# Altium schematic sheet Tead_Aliens_64A_Display.SchDoc: Tead Aliens 64A Display
size A4; Date: 23/01/2021; CheckedBy: Nepermath; Author: Nepermath; DrawnBy: Nepermath; Engineer: Nepermath; DocumentNumber: Nepermath; Revision: 1; SheetNumber: 1; SheetTotal: 1; CurrentTime: 14:51; CurrentDate: 23/01/2021; Time: 23:01
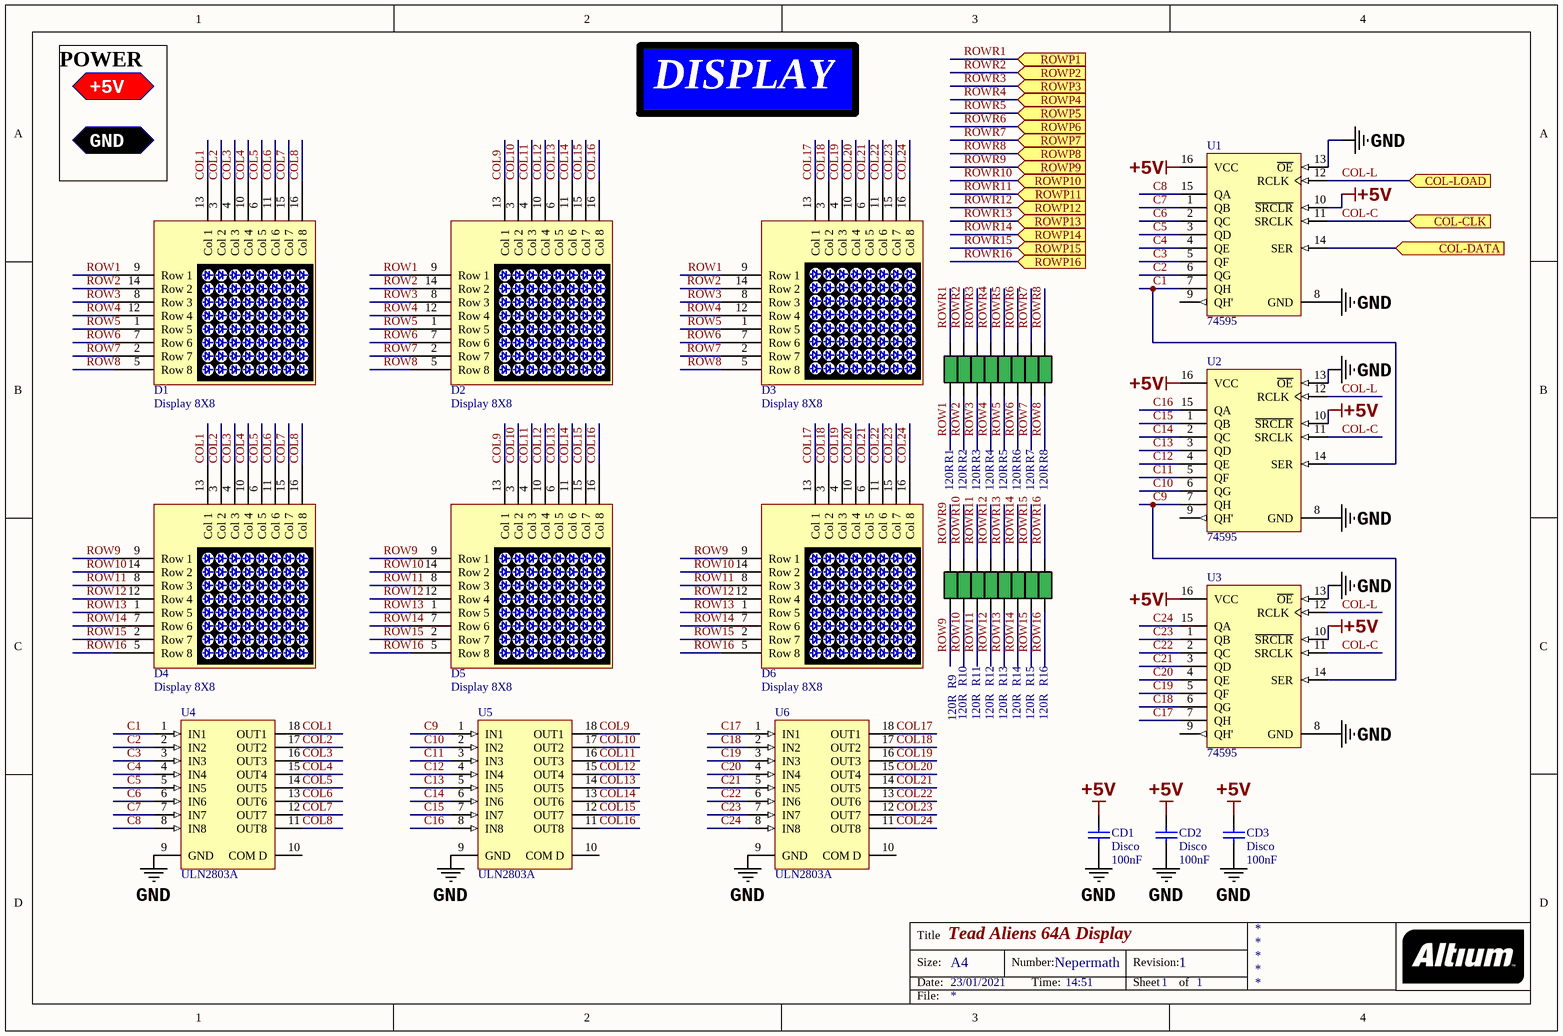
[diagram p0: Tead_Aliens_64A_Display.SchDoc]

## Parts
CD1  Disco  value 100nF  [CAP CER DISK 3MM]
CD2  Disco  value 100nF  [CAP CER DISK 3MM]
CD3  Disco  value 100nF  [CAP CER DISK 3MM]
D1  Display 8X8  [DISPLAY_2088BS_DIP_2X8]
D2  Display 8X8  [DISPLAY_2088BS_DIP_2X8]
D3  Display 8X8  [DISPLAY_2088BS_DIP_2X8]
D4  Display 8X8  [DISPLAY_2088BS_DIP_2X8]
D5  Display 8X8  [DISPLAY_2088BS_DIP_2X8]
D6  Display 8X8  [DISPLAY_2088BS_DIP_2X8]
R1  value 120R  [RES_0805]  (hidden comment: Resistor Generic)
R2  value 120R  [RES_0805]  (hidden comment: Resistor Generic)
R3  value 120R  [RES_0805]  (hidden comment: Resistor Generic)
R4  value 120R  [RES_0805]  (hidden comment: Resistor Generic)
R5  value 120R  [RES_0805]  (hidden comment: Resistor Generic)
R6  value 120R  [RES_0805]  (hidden comment: Resistor Generic)
R7  value 120R  [RES_0805]  (hidden comment: Resistor Generic)
R8  value 120R  [RES_0805]  (hidden comment: Resistor Generic)
R9  value 120R  [RES_0805]  (hidden comment: Resistor Generic)
R10  value 120R  [RES_0805]  (hidden comment: Resistor Generic)
R11  value 120R  [RES_0805]  (hidden comment: Resistor Generic)
R12  value 120R  [RES_0805]  (hidden comment: Resistor Generic)
R13  value 120R  [RES_0805]  (hidden comment: Resistor Generic)
R14  value 120R  [RES_0805]  (hidden comment: Resistor Generic)
R15  value 120R  [RES_0805]  (hidden comment: Resistor Generic)
R16  value 120R  [RES_0805]  (hidden comment: Resistor Generic)
U1  74595  [DIP16]
U2  74595  [DIP16]
U3  74595  [DIP16]
U4  ULN2803A  [DIP18]
U5  ULN2803A  [DIP18]
U6  ULN2803A  [DIP18]

## Ports
+5V, COL-CLK (in), COL-DATA (in), COL-LOAD (in), GND, ROWP1 (in), ROWP2 (in), ROWP3 (in), ROWP4 (in), ROWP5 (in), ROWP6 (in), ROWP7 (in), ROWP8 (in), ROWP9 (in), ROWP10 (in), ROWP11 (in), ROWP12 (in), ROWP13 (in), ROWP14 (in), ROWP15 (in), ROWP16 (in)

## Nets
+5V: CD1.1 CD2.1 CD3.1 U1.10(~{SRCLR}) U1.16(VCC) U2.10(~{SRCLR}) U2.16(VCC) U3.10(~{SRCLR}) U3.16(VCC)
GND: CD1.2 CD2.2 CD3.2 U1.8(GND) U1.13(~{OE}) U2.8(GND) U2.13(~{OE}) U3.8(GND) U3.13(~{OE}) U4.9(GND) U5.9(GND) U6.9(GND)
C1: U1.7(QH) U2.14(SER) U4.1(IN1)
C2: U1.6(QG) U4.2(IN2)
C3: U1.5(QF) U4.3(IN3)
C4: U1.4(QE) U4.4(IN4)
C5: U1.3(QD) U4.5(IN5)
C6: U1.2(QC) U4.6(IN6)
C7: U1.1(QB) U4.7(IN7)
C8: U1.15(QA) U4.8(IN8)
C9: U2.7(QH) U3.14(SER) U5.1(IN1)
C10: U2.6(QG) U5.2(IN2)
C11: U2.5(QF) U5.3(IN3)
C12: U2.4(QE) U5.4(IN4)
C13: U2.3(QD) U5.5(IN5)
C14: U2.2(QC) U5.6(IN6)
C15: U2.1(QB) U5.7(IN7)
C16: U2.15(QA) U5.8(IN8)
C17: U3.7(QH) U6.1(IN1)
C18: U3.6(QG) U6.2(IN2)
C19: U3.5(QF) U6.3(IN3)
C20: U3.4(QE) U6.4(IN4)
C21: U3.3(QD) U6.5(IN5)
C22: U3.2(QC) U6.6(IN6)
C23: U3.1(QB) U6.7(IN7)
C24: U3.15(QA) U6.8(IN8)
COL1: D1.13(Col_1) D4.13(Col_1) U4.18(OUT1)
COL2: D1.3(Col_2) D4.3(Col_2) U4.17(OUT2)
COL3: D1.4(Col_3) D4.4(Col_3) U4.16(OUT3)
COL4: D1.10(Col_4) D4.10(Col_4) U4.15(OUT4)
COL5: D1.6(Col_5) D4.6(Col_5) U4.14(OUT5)
COL6: D1.11(Col_6) D4.11(Col_6) U4.13(OUT6)
COL7: D1.15(Col_7) D4.15(Col_7) U4.12(OUT7)
COL8: D1.16(Col_8) D4.16(Col_8) U4.11(OUT8)
COL9: D2.13(Col_1) D5.13(Col_1) U5.18(OUT1)
COL10: D2.3(Col_2) D5.3(Col_2) U5.17(OUT2)
COL11: D2.4(Col_3) D5.4(Col_3) U5.16(OUT3)
COL12: D2.10(Col_4) D5.10(Col_4) U5.15(OUT4)
COL13: D2.6(Col_5) D5.6(Col_5) U5.14(OUT5)
COL14: D2.11(Col_6) D5.11(Col_6) U5.13(OUT6)
COL15: D2.15(Col_7) D5.15(Col_7) U5.12(OUT7)
COL16: D2.16(Col_8) D5.16(Col_8) U5.11(OUT8)
COL17: D3.13(Col_1) D6.13(Col_1) U6.18(OUT1)
COL18: D3.3(Col_2) D6.3(Col_2) U6.17(OUT2)
COL19: D3.4(Col_3) D6.4(Col_3) U6.16(OUT3)
COL20: D3.10(Col_4) D6.10(Col_4) U6.15(OUT4)
COL21: D3.6(Col_5) D6.6(Col_5) U6.14(OUT5)
COL22: D3.11(Col_6) D6.11(Col_6) U6.13(OUT6)
COL23: D3.15(Col_7) D6.15(Col_7) U6.12(OUT7)
COL24: D3.16(Col_8) D6.16(Col_8) U6.11(OUT8)
COL-C: U1.11(SRCLK) U2.11(SRCLK) U3.11(SRCLK) ; port COL-CLK
COL-DATA: U1.14(SER) ; port COL-DATA
COL-L: U1.12(RCLK) U2.12(RCLK) U3.12(RCLK) ; port COL-LOAD
ROW1: D1.9(Row_1) D2.9(Row_1) D3.9(Row_1) R1.1
ROW2: D1.14(Row_2) D2.14(Row_2) D3.14(Row_2) R2.1
ROW3: D1.8(Row_3) D2.8(Row_3) D3.8(Row_3) R3.1
ROW4: D1.12(Row_4) D2.12(Row_4) D3.12(Row_4) R4.1
ROW5: D1.1(Row_5) D2.1(Row_5) D3.1(Row_5) R5.1
ROW6: D1.7(Row_6) D2.7(Row_6) D3.7(Row_6) R6.1
ROW7: D1.2(Row_7) D2.2(Row_7) D3.2(Row_7) R7.1
ROW8: D1.5(Row_8) D2.5(Row_8) D3.5(Row_8) R8.1
ROW9: D4.9(Row_1) D5.9(Row_1) D6.9(Row_1) R9.1
ROW10: D4.14(Row_2) D5.14(Row_2) D6.14(Row_2) R10.1
ROW11: D4.8(Row_3) D5.8(Row_3) D6.8(Row_3) R11.1
ROW12: D4.12(Row_4) D5.12(Row_4) D6.12(Row_4) R12.1
ROW13: D4.1(Row_5) D5.1(Row_5) D6.1(Row_5) R13.1
ROW14: D4.7(Row_6) D5.7(Row_6) D6.7(Row_6) R14.1
ROW15: D4.2(Row_7) D5.2(Row_7) D6.2(Row_7) R15.1
ROW16: D4.5(Row_8) D5.5(Row_8) D6.5(Row_8) R16.1
ROWR1: R1.2 ; port ROWP1
ROWR2: R2.2 ; port ROWP2
ROWR3: R3.2 ; port ROWP3
ROWR4: R4.2 ; port ROWP4
ROWR5: R5.2 ; port ROWP5
ROWR6: R6.2 ; port ROWP6
ROWR7: R7.2 ; port ROWP7
ROWR8: R8.2 ; port ROWP8
ROWR9: R9.2 ; port ROWP9
ROWR10: R10.2 ; port ROWP10
ROWR11: R11.2 ; port ROWP11
ROWR12: R12.2 ; port ROWP12
ROWR13: R13.2 ; port ROWP13
ROWR14: R14.2 ; port ROWP14
ROWR15: R15.2 ; port ROWP15
ROWR16: R16.2 ; port ROWP16

Not connected (* = marked no-connect by the designer): U1 9(QH'); U2 9(QH'); U3 9(QH'); U4 10(COM_D); U5 10(COM_D); U6 10(COM_D)

## Notes on the sheet
- DISPLAY
- (near D1) POWER
- Title
- Size:
- Date:
- A4
- Number:
- Time:
- Revision:
- Sheet
- of
- File:

## Library data of the parts
CD1-CD3 = CAP_DISCO: SMD Capacitor 1210 size
D1-D6 = Display 2088BS 8x8 60mm X 60 mm: Display Dot LED 8x8  60mm X 60 mm
R1-R16 = Resistor Generic: Generic Resistor
U1-U3 = 74595 Generico L,H,HC,F,LS: 74595 Generico L,H,LC,HC,F,LS
U4-U6 = ULN2803A: Eight Darlington Array; Published: 8-Jun-2000; LatestRevisionDate: 06-Jun-2005; LatestRevisionNote: Stylized 3D Model Added.; DatasheetVersion: Sep-1997; PackageReference: DIP18; Publisher: Altium Limited; PackageDescription: DIP; 18 Leads; Row Spacing 7.62 mm; Pitch 2.54 mm; ComponentLink1Description: Manufacturer Link; ComponentLink1URL: http://www.st.com/; ComponentLink2Description: Datasheet; ComponentLink2URL: http://www.st.com/stonline/products/literature/ds/1536/uln2801a.pdf